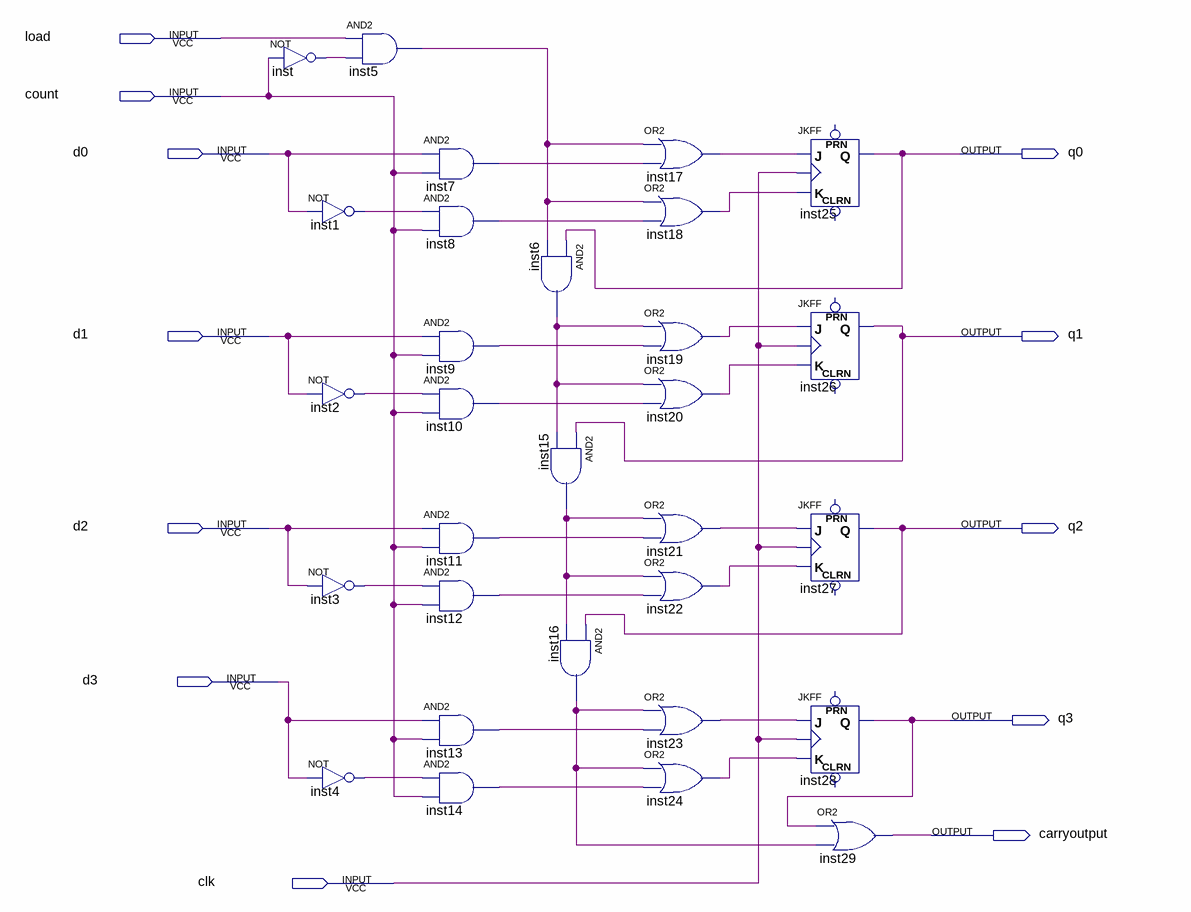
[diagram p0: schematic sheet]
// Quartus schematic fourbitcounter1.bdf as structural Verilog: 30 symbols, 12 pins
module fourbitcounter1 (
  input  load,
  input  count,
  input  d0,
  input  d1,
  input  d2,
  input  d3,
  input  clk,
  output q0,
  output q1,
  output q2,
  output q3,
  output carryoutput
);

  wire inst1_out, inst2_out, inst3_out, inst4_out, inst5_out, inst6_out, inst7_out, inst8_out, inst9_out,
       inst10_out, inst11_out, inst12_out, inst13_out, inst14_out, inst15_out, inst16_out, inst17_out,
       inst18_out, inst19_out, inst20_out, inst21_out, inst22_out, inst23_out, inst24_out, inst_out;

  not inst (inst_out, count);
  not inst1 (inst1_out, d0);
  not inst2 (inst2_out, d1);
  not inst3 (inst3_out, d2);
  not inst4 (inst4_out, d3);
  and inst5 (inst5_out, load, inst_out);
  and inst7 (inst7_out, d0, count);
  and inst8 (inst8_out, inst1_out, count);
  and inst9 (inst9_out, d1, count);
  and inst10 (inst10_out, inst2_out, count);
  and inst11 (inst11_out, d2, count);
  and inst12 (inst12_out, inst3_out, count);
  and inst13 (inst13_out, d3, count);
  and inst14 (inst14_out, inst4_out, count);
  and inst6 (inst6_out, q0, inst5_out);
  and inst15 (inst15_out, q1, inst6_out);
  and inst16 (inst16_out, q2, inst15_out);
  or inst17 (inst17_out, inst5_out, inst7_out);
  or inst18 (inst18_out, inst5_out, inst8_out);
  or inst19 (inst19_out, inst6_out, inst9_out);
  or inst20 (inst20_out, inst6_out, inst10_out);
  or inst21 (inst21_out, inst15_out, inst11_out);
  or inst22 (inst22_out, inst15_out, inst12_out);
  or inst23 (inst23_out, inst16_out, inst13_out);
  or inst24 (inst24_out, inst16_out, inst14_out);
  JKFF inst25 (.K(inst18_out), .J(inst17_out), .CLK(clk), .Q(q0));  // open: PRN, CLRN
  JKFF inst26 (.K(inst20_out), .J(inst19_out), .CLK(clk), .Q(q1));  // open: PRN, CLRN
  JKFF inst27 (.K(inst22_out), .J(inst21_out), .CLK(clk), .Q(q2));  // open: PRN, CLRN
  JKFF inst28 (.K(inst24_out), .J(inst23_out), .CLK(clk), .Q(q3));  // open: PRN, CLRN
  or inst29 (carryoutput, q3, inst16_out);
endmodule
